# EasyEDA schematic FFB_Arduino_Yoke_2.0_ProMicro.json
TITLE: FFB Arduino Yoke; REV: 2.0; Date: 08.01.2025; Sheet: 1/1; Company: Gagagu
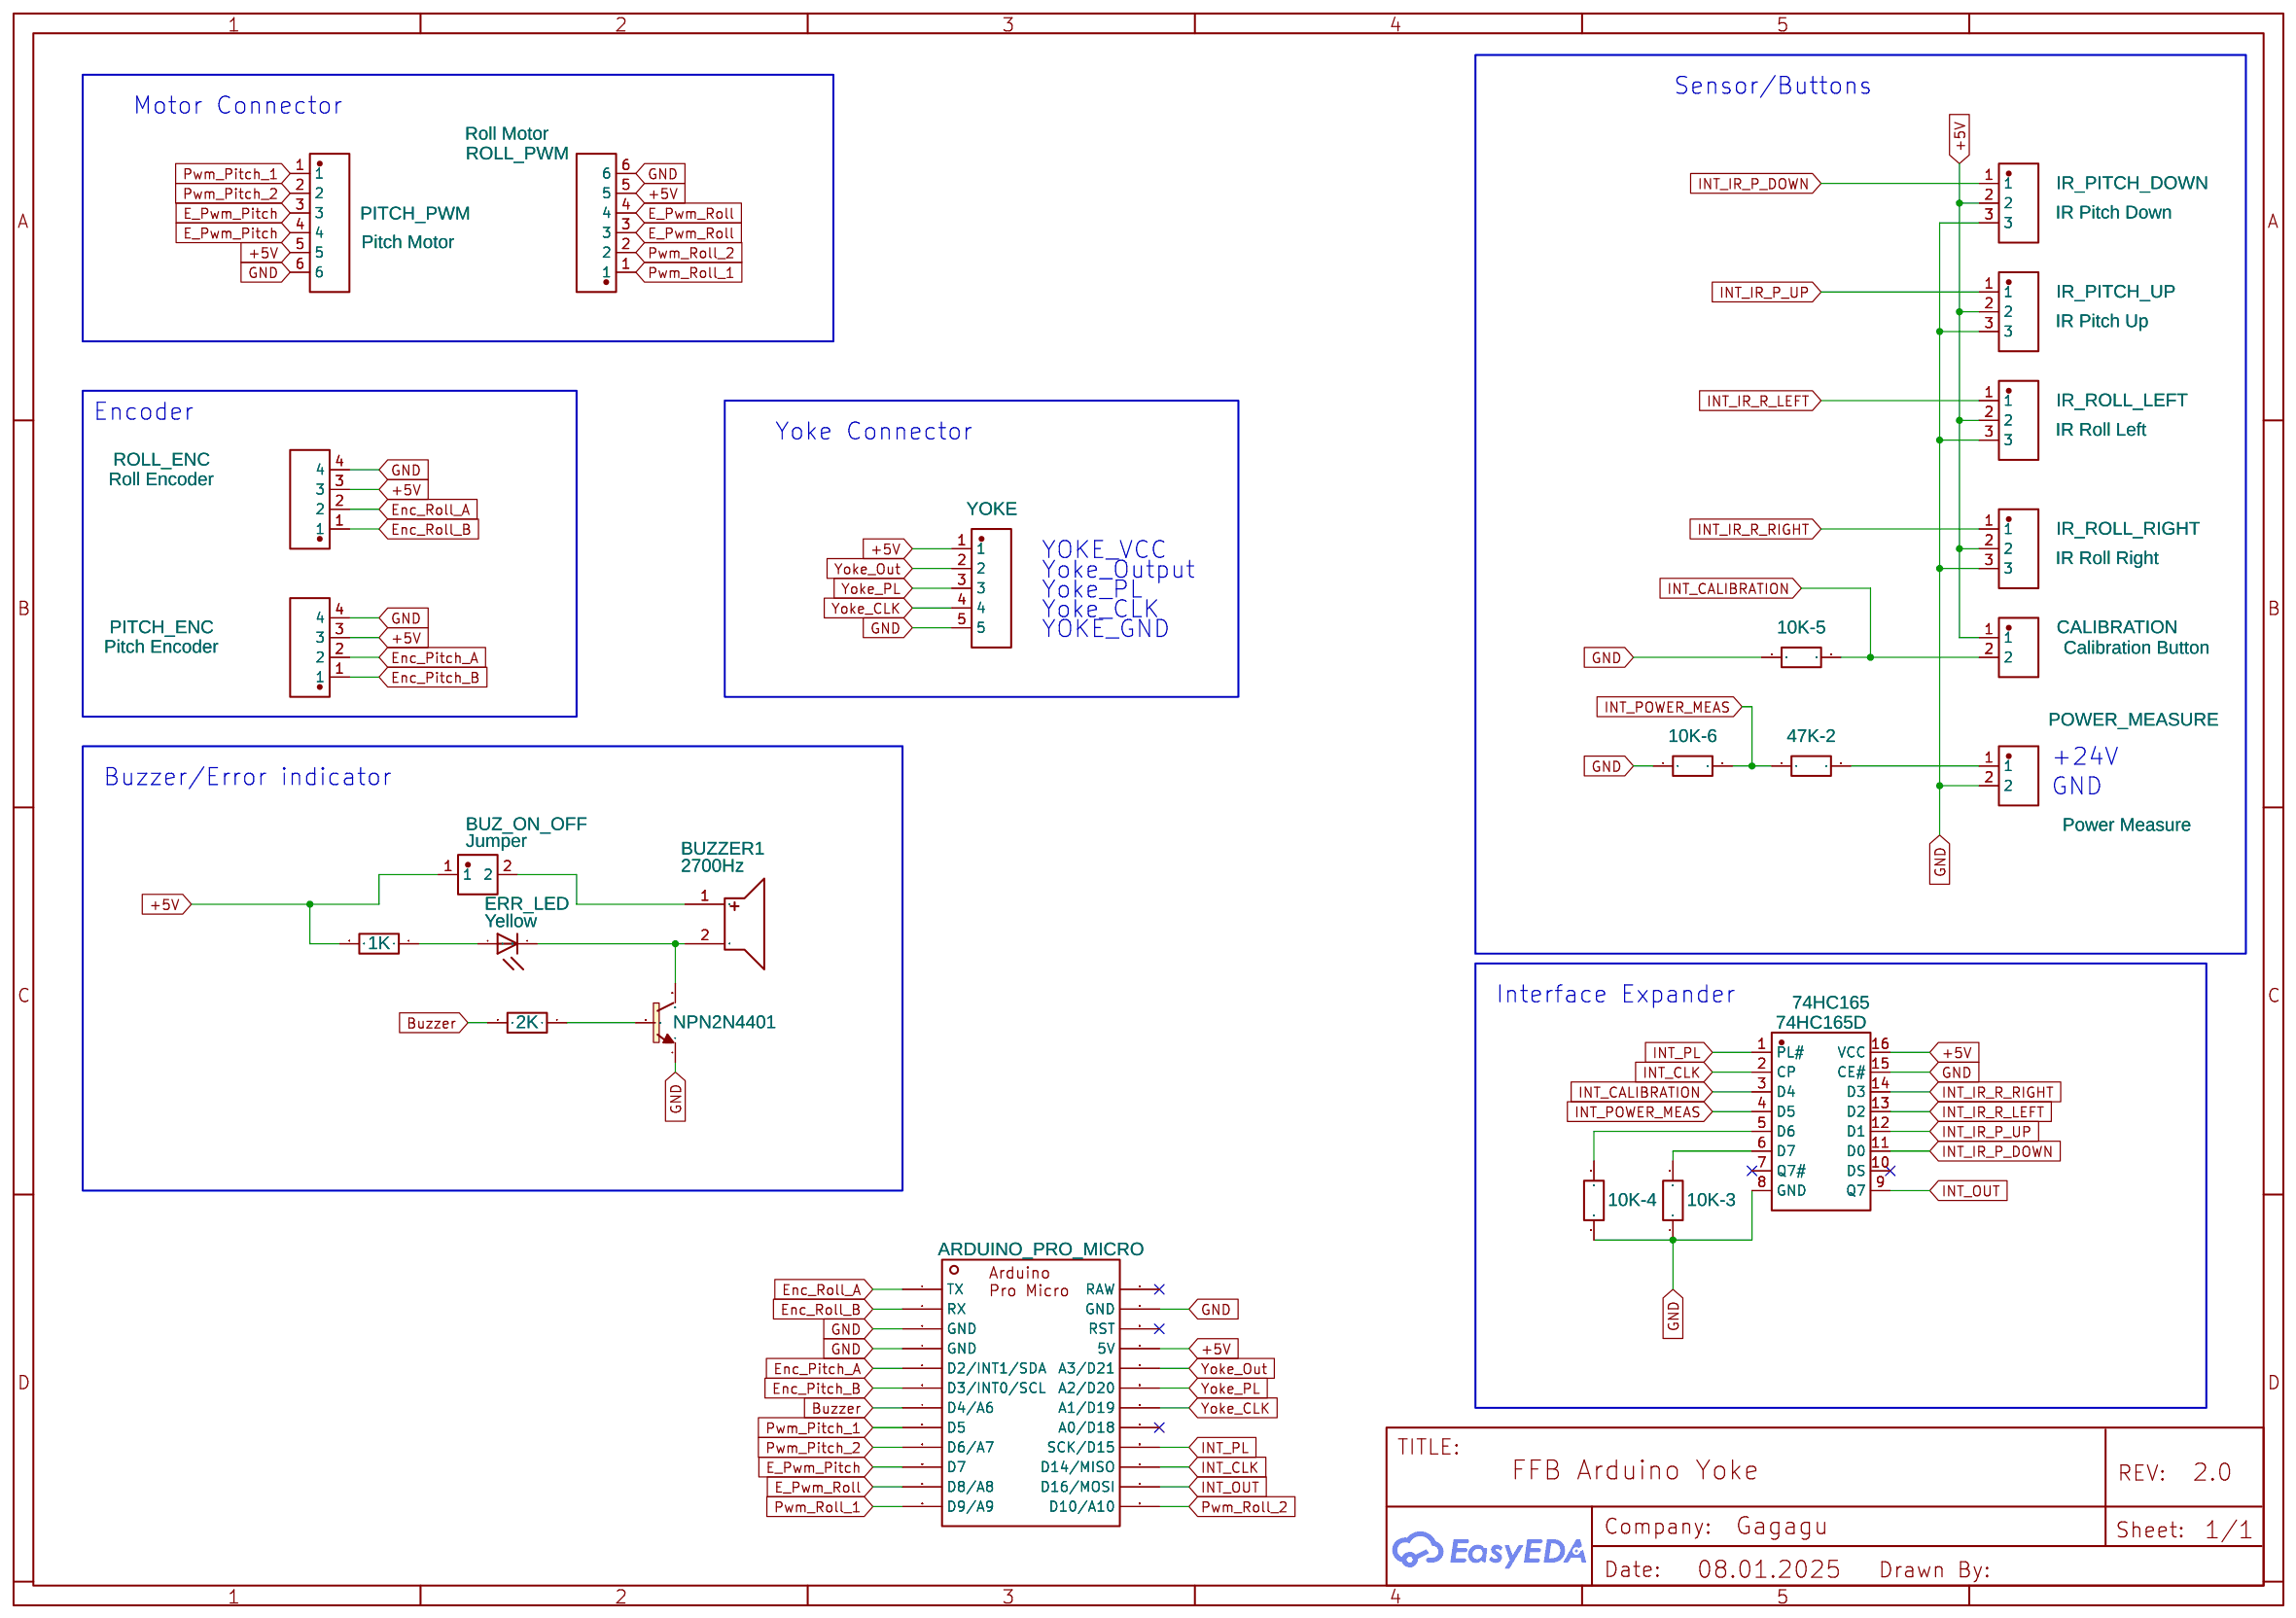
[diagram p0: schematic sheet]

## Parts
1K  10k  [R_AXIAL-0.4]
2K  10k  [R_AXIAL-0.4]
2N4401  NPN2N4401  [2N4401]
10K-3  10k  [R_AXIAL-0.4]
10K-4  10k  [R_AXIAL-0.4]
10K-5  10k  [R_AXIAL-0.4]
10K-6  10k  [R_AXIAL-0.4]
47K-2  47k  [R_AXIAL-0.4]
74HC165  74HC165D  [PDIP-16_L19.2-W6.6-P2.54-LS7.6-BL]
ARDUINO_PRO_MICRO  ArduinoProMicro  [ARDUINOPROMICRO_RA]
BUZ_ON_OFF  Jumper  [HDR-TH_2P-P2.54-V-M-1]
BUZZER1  2700Hz  [BUZ-TH_BD9.0-P4.00-D0.6-FD]
CALIBRATION  Calibration Button  [CONN-TH_2P-P2.54_MX128-2.54-GN01-02P-CU-Y-A]
ERR_LED  Yellow  [LED_LED3MM]
IR_PITCH_DOWN  IR Pitch Down  [CONN-TH_3P-P2.54_MX128-2.54-03P-GN01-CU-Y-A]
IR_PITCH_UP  IR Pitch Up  [CONN-TH_3P-P2.54_MX128-2.54-03P-GN01-CU-Y-A]
IR_ROLL_LEFT  IR Roll Left  [CONN-TH_3P-P2.54_MX128-2.54-03P-GN01-CU-Y-A]
IR_ROLL_RIGHT  IR Roll Right  [CONN-TH_3P-P2.54_MX128-2.54-03P-GN01-CU-Y-A]
PITCH_ENC  Pitch Encoder  [CONN-TH_4P-P2.54_MX128-2.54-GN01-04P-CU-Y-A]
PITCH_PWM  Pitch Motor  [CONN-TH_6P-P2.54_MX128-2.54-6P]
POWER_MEASURE  Power Measure  [CONN-TH_2P-P2.54_MX128-2.54-GN01-02P-CU-Y-A]
ROLL_ENC  Roll Encoder  [CONN-TH_4P-P2.54_MX128-2.54-GN01-04P-CU-Y-A]
ROLL_PWM  Roll Motor  [CONN-TH_6P-P2.54_MX128-2.54-6P]
YOKE  Yoke  [CONN-TH_5P-P2.54_MX128-2.54-05P-GN01-CU-Y-A]

## Library data of the parts
1K 2K 10K-3-10K-6 47K-2 = R_AXIAL-0.3_EU: Contributor: LCEDA_Lib
2N4401 = NPN2N4401: Contributor: elliotth
74HC165 = AIP74HC165DA.TB: Contributor: LCSC; Supplier: LCSC; Supplier Part: C2961882; Manufacturer: I-CORE(中微爱芯); Manufacturer Part: AiP74HC165DA.TB; JLCPCB Part Class: Extended Part
ARDUINO_PRO_MICRO = ArduinoProMicro_Ra: Contributor: Teera Yoosuk
BUZ_ON_OFF = XG8T-0231: Contributor: lcsc; Supplier: LCSC; Supplier Part: C3326327; Manufacturer: OMRON(欧姆龙); JLCPCB Part Class: Extended Part
BUZZER1 = QMB-09B-03: Contributor: LCSC; Supplier: LCSC; Manufacturer: 华能; Supplier Part: C96256; JLCPCB Part Class: Extended Part
CALIBRATION POWER_MEASURE = MX128-2.54-02P-GN01-CU-Y-A: Supplier: LCSC; Supplier Part: C5188442; Manufacturer: MAX(迈旭); Manufacturer Part: MX128-2.54-02P-GN01-Cu-Y-A; JLCPCB Part Class: Extended Part; Contributor: lcsc
ERR_LED = LED 3MM COPY: LED
IR_PITCH_DOWN IR_PITCH_UP IR_ROLL_LEFT IR_ROLL_RIGHT = MX128-2.54-03P-GN01-CU-Y-A: Supplier: LCSC; Supplier Part: C5188443; Manufacturer: MAX(迈旭); Manufacturer Part: MX128-2.54-03P-GN01-Cu-Y-A; Contributor: lcsc; JLCPCB Part Class: Extended Part
PITCH_ENC ROLL_ENC = MX128-2.54-04P-GN01-CU-Y-A: Supplier: LCSC; Supplier Part: C5188444; Manufacturer: MAX(迈旭); Manufacturer Part: MX128-2.54-04P-GN01-Cu-Y-A; JLCPCB Part Class: Extended Part; Contributor: lcsc
PITCH_PWM ROLL_PWM = MX128-2.54-GN01-06P-CU-Y-A: Contributor: lcsc; Supplier: LCSC; Supplier Part: C5188446; Manufacturer: MAX(迈旭); Manufacturer Part: MX128-2.54-GN01-06P-Cu-Y-A; JLCPCB Part Class: Extended Part
YOKE = MX128-2.54-05P-GN01-CU-Y-A: Supplier: LCSC; Supplier Part: C5188445; Manufacturer: MAX(迈旭); Manufacturer Part: MX128-2.54-05P-GN01-Cu-Y-A; Contributor: Sauro Giovanetti; JLCPCB Part Class: Extended Part

## Nets
+5V: 1K.2 74HC165.16(VCC) ARDUINO_PRO_MICRO.21(5V) BUZ_ON_OFF.1 CALIBRATION.1 IR_PITCH_DOWN.2 IR_PITCH_UP.2 IR_ROLL_LEFT.2 IR_ROLL_RIGHT.2 PITCH_ENC.3 PITCH_PWM.5 ROLL_ENC.3 ROLL_PWM.5 YOKE.1
GND: 2N4401.E 10K-3.1 10K-4.1 10K-5.1 10K-6.1 74HC165.8(GND) 74HC165.15(CE#) ARDUINO_PRO_MICRO.3(GND) ARDUINO_PRO_MICRO.4(GND) ARDUINO_PRO_MICRO.23(GND) IR_PITCH_DOWN.3 IR_PITCH_UP.3 IR_ROLL_LEFT.3 IR_ROLL_RIGHT.3 PITCH_ENC.4 PITCH_PWM.6 POWER_MEASURE.2 ROLL_ENC.4 ROLL_PWM.6 YOKE.5
Buzzer: 2K.2 ARDUINO_PRO_MICRO.7(D4/A6)
E_Pwm_Pitch: ARDUINO_PRO_MICRO.10(D7) PITCH_PWM.3 PITCH_PWM.4
E_Pwm_Roll: ARDUINO_PRO_MICRO.11(D8/A8) ROLL_PWM.3 ROLL_PWM.4
Enc_Pitch_A: ARDUINO_PRO_MICRO.5(D2/INT1/SDA) PITCH_ENC.2
Enc_Pitch_B: ARDUINO_PRO_MICRO.6(D3/INT0/SCL) PITCH_ENC.1
Enc_Roll_A: ARDUINO_PRO_MICRO.1(TX) ROLL_ENC.2
Enc_Roll_B: ARDUINO_PRO_MICRO.2(RX) ROLL_ENC.1
INT_CALIBRATION: 10K-5.2 74HC165.3(D4) CALIBRATION.2
INT_CLK: 74HC165.2(CP) ARDUINO_PRO_MICRO.15(D14/MISO)
INT_IR_P_DOWN: 74HC165.11(D0) IR_PITCH_DOWN.1
INT_IR_P_UP: 74HC165.12(D1) IR_PITCH_UP.1
INT_IR_R_LEFT: 74HC165.13(D2) IR_ROLL_LEFT.1
INT_IR_R_RIGHT: 74HC165.14(D3) IR_ROLL_RIGHT.1
INT_OUT: 74HC165.9(Q7) ARDUINO_PRO_MICRO.14(D16/MOSI)
INT_PL: 74HC165.1(PL#) ARDUINO_PRO_MICRO.16(SCK/D15)
INT_POWER_MEAS: 10K-6.2 47K-2.1 74HC165.4(D5)
Pwm_Pitch_1: ARDUINO_PRO_MICRO.8(D5) PITCH_PWM.1
Pwm_Pitch_2: ARDUINO_PRO_MICRO.9(D6/A7) PITCH_PWM.2
Pwm_Roll_1: ARDUINO_PRO_MICRO.12(D9/A9) ROLL_PWM.1
Pwm_Roll_2: ARDUINO_PRO_MICRO.13(D10/A10) ROLL_PWM.2
Yoke_CLK: ARDUINO_PRO_MICRO.18(A1/D19) YOKE.4
Yoke_Out: ARDUINO_PRO_MICRO.20(A3/D21) YOKE.2
Yoke_PL: ARDUINO_PRO_MICRO.19(A2/D20) YOKE.3
Net-(1K-1): 1K.1 ERR_LED.A
Net-(2K-1): 2K.1 2N4401.B
Net-(2N4401-C): 2N4401.C BUZZER1.2 ERR_LED.K(C)
Net-(10K-3-2): 10K-3.2 74HC165.6(D7)
Net-(10K-4-2): 10K-4.2 74HC165.5(D6)
Net-(47K-2-2): 47K-2.2 POWER_MEASURE.1
Net-(BUZ_ON_OFF-2): BUZ_ON_OFF.2 BUZZER1.1

Not connected (* = marked no-connect by the designer): 74HC165 7(Q7#)* 10(DS)*; ARDUINO_PRO_MICRO 17(A0/D18)* 22(RST)* 24(RAW)*

## Notes on the sheet
- Sensor/Buttons
- Motor Connector
- Encoder
- Yoke Connector
- YOKE_VCC
- Yoke_Output
- Yoke_PL
- Yoke_CLK
- YOKE_GND
- +24V
- Buzzer/Error indicator
- GND
- Interface Expander
- Gagagu
